# EAGLE design design1 (EAGLE 7.3.0)
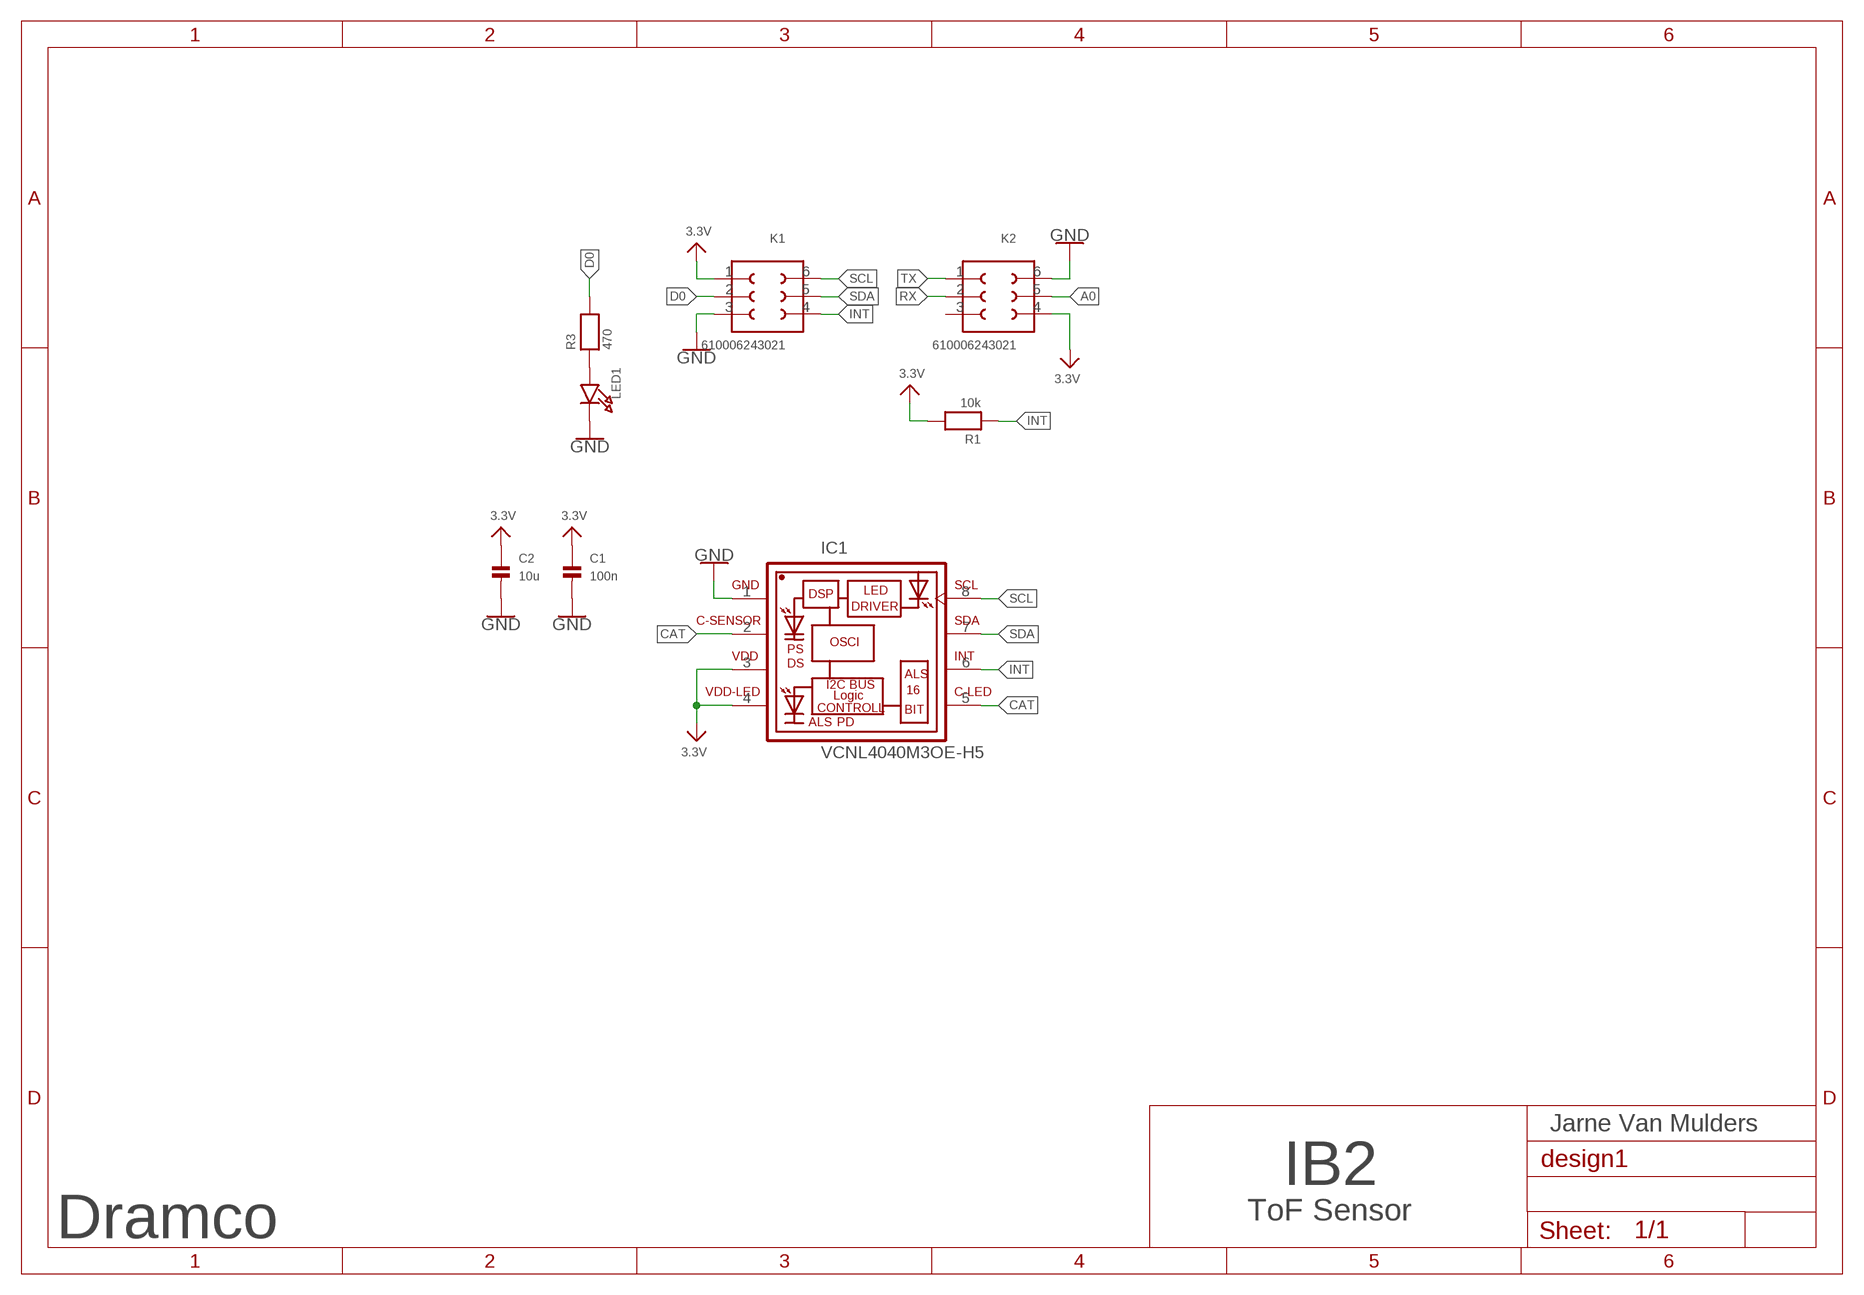
[diagram p0: schematic, sheet 1]

## Parts
C1  100n  CAP_CERAMIC0603  [0603]
C2  10u  CAP_CERAMIC0805  [0805]
IC1  VCNL4040M3OE-H5  [VISHAY_VCNL4040_4.34X2.35X3.65]
K1  610006243021  [610006243021]
K2  610006243021  [610006243021]
LED1  LED0805  [CHIPLED_0805]
R1  10k  RESISTOR0603  [0603]
R3  470  RESISTOR0603  [0603]

## Nets
3.3V: C1.1 C2.1 IC1.3(VDD) IC1.4(VDD-LED) K1.1 K2.4 R1.2
A0: K2.5
CAT: IC1.2(C-SENSOR) IC1.5(C-LED)
D0: K1.2 R3.2
GND: C1.2 C2.2 IC1.1(GND) K1.3 K2.6 LED1.C
INT: IC1.6(INT) K1.4 R1.1
N$3: LED1.A R3.1
RX: K2.2
SCL: IC1.8(SCL) K1.6
SDA: IC1.7(SDA) K1.5
TX: K2.1
Unconnected: K2.3

## Notes on the sheet
- Jarne Van Mulders
- IB2
- ToF Sensor
- Dramco

## Library data of the parts
C1 C2 = microbuilder:CAP_CERAMIC: Ceramic Capacitors 0402 - 0402 Surface Mount Capacitors 16pF 50V 5% [Digikey: 445-4899-2-ND] 18pF 50V 5% [Digikey: 490-1281-2-ND] 22pF 50V 5% [Digikey: 490-1283-2-ND] 68pF 50V 5% [Digikey: 490-1289-2-ND] 0.1uF 10V 10% [Digikey: 490-1318-2-ND] 1.0uF 6.3V 10% [Digikey: 490-1320-2-ND] 0603 - 0603 Surface Mount Capacitors 16 pF 50V 5% [Digikey: 445-5051-2-ND] 22 pF 50V [Digikey: PCC220ACVTR-ND] 33 pF 50V 5% [Digikey: 490-1415-1-ND] 56pF 50V 5% [Digikey: 490-1421-1-ND] 220pF 50V 5% [Digikey: 445-1285-1-ND] 680 pF 50V 2200 pF 50V 5% C0G [Digikey: 445-1297-1-ND] 5600 pF 100V 5% X7R [Digikey: 478-3711-1-ND] 0.1 µF 25V 10% [Digikey: PCC2277TR-ND] 0.22 µF 16V 10% X7R [Digikey: 445-1318-1-ND] 1.0 µF 25V 10% [Digikey: 445-5146-2-ND] 0603 - RF Specific 3pF 250V +/-0.1pF RF [Digikey: 712-1347-1-ND] 18 pF 250V 5% [Digikey: 478-3505-1-ND or 712-1322-1-ND] 56 pF 250V 5% C0G RF [Digikey: 490-4867-1-ND] 68 pF 250V RF [Digikey: 490-4868-1-ND] 0805 - 0805 Surface Mount Capacitors 220 pF 250V 2% RF Ceramic Capacitor [Digikey: 712-1398-1-ND] 1000 pF 50V 2% NP0 Ceramic Capacitor [Digikey: 478-3760-1-ND] 0.1 µF 25V 10% Ceramic Capacitor [Digikey: PCC1828TR-ND] 1.0 µF 16V 10% Ceramic Capacitor[Digikey: 490-1691-2-ND] 10.0 µF 10V 10% Ceramic Capacitor[Digikey: 709-1228-1-ND] 10.0 uF 16V 10% Ceramic Capacitor [Digikey: 478-5165-2-ND] 47 uF 6.3V 20% Ceramic Capacitor [Digikey: 587-1779-1-ND or 399-5506-1-ND] 1206 - 1206 Surface Mount Capacitors 47uF 10V 20% Ceramic Capacitor [Digikey: 490-5528-1-ND or 399-5508-1-ND or 445-6010-1-ND] 100uF 6.3V -20%, +80% Y5V Ceramic Capacitor (Digikey: 490-4512-1-ND, Mouser: 81-GRM31CF50J107ZE1L)
IC1 = VCNL4040M3OE-H5:VCNL4040M3OE-H5: VCNL4040 Fully Integrated Proximity and Ambient Light Sensor with Infrared Emitter, I2C Interface, and Interrupt Function: VCNL4040 integrates a proximity sensor (PS), ambient light sensor (ALS), and a high power IRED into one small package. It incorporates photodiodes, amplifiers, and analog to digital converting circuits into a single chip by CMOS process. The 16-bit high resolution ALS offers excellent sensing capabilities with sufficient selections to fulfill most applications whether dark or high transparency lens design. High and low interrupt thresholds can be programmed for both ALS and PS, allowing the component to use a minimal amount of the microcontrollers resources. Device Model created 15.06.2016 by Johannes Kolb - Vishay Semiconductor GmbH Check prices <https://pricing.snapeda.com/parts/VCNL4040M3OE-H5/Vishay%20Semiconductor/view-part?ref=eda>; AVAILABILITY: In Stock; DESCRIPTION: Optical Sensor Ambient 550nm I²C 8-SMD Module; MF: Vishay Semiconductor; MP: VCNL4040M3OE-H5; PACKAGE: SMD-8 Vishay; PRICE: None; PURCHASE-URL: https://pricing.snapeda.com/search/part/VCNL4040M3OE-H5/?ref=eda
K1 K2 = Wurth_Elektronik_Electromechanic_Board_to_Board_Connectors_rev15c:610006243021: WR-PHD 2.54mm SMT Dual Socket Header Bottom Entry, 6 Pins=>Code : Con_BTB_SHD_2.54_2_610006243021 <http://katalog.we-online.de/media/images/eican/Con_BTB_SHD_2.54_2_6100xx243021_pf2.jpg> Details see: http://katalog.we-online.de/en/em/610_0xx_243_021 Created 2014-05-30, Karrer Zheng 2014 (C) Würth Elektronik
LED1 = microbuilder:LED: LED 0603 - 0603 Surface Mount Package 2mA: Green LED - Low Power (3.9mcd, 2ma, 1.7Vf) - Digikey: 475-2709-2-ND Orange LED - Low Power (9.8mcd, 2ma, 1.8Vf) - Digikey: 475-1194-2-ND Red LED - Low Power (5mcd, 2ma, 1.8Vf) - Digikey: 475-1195-2-ND Yellow LED - Low Power (7mcd, 2ma, 1.8Vf) - Digikey: 475-1196-2-ND 5mA: Blue LED - Low Power (17mcd, 5ma, 2.9Vf) - Digikey: LNJ937W8CRACT-ND 0805 - 0805 Surface Mount Package 2mA: Red LED (8.8mcd, 2mA, 1.8Vf, Clear) - Low Power [Digikey: 475-2510-1-ND] Green LED (5mcd, 2mA, 1.8Vf, Clear) - Low Power [Digikey: 475-2730-1-ND] Yellow LED (11.3mcd, 2mA, 1.8Vf, Clear) - Low Power [Digikey: 475-2555-1-ND] 20mA: Red LED (104mcd, 20mA, Diffused) - LS R976 [Digikey: 475-1278-6-ND] Red LED (12mcd, 20mA, 2.0Vf, Clear) - APT2012EC [Digikey: 754-1128-1-ND] Green LED (15mcd, 20mA, 2.2Vf, Clear) - APT2012GC [Digikey: 754-1131-1-ND] Orange LED (160mcd, 20mA, 2.1Vf, Clear) - APT2012SECK [Digikey: 754-1130-1-ND] 1206 - 1206 Surface Mount Package Green LED (26mcd, 20mA, Diffused) - LG N971 [Digikey: 475-1407-6-ND] Red LED (15mcd, 20mA, Diffused) - LH N974 [Digikey: 475-1416-6-ND]
R1 R3 = microbuilder:RESISTOR: Resistors 0402 - 0402 Surface Mount Package 22 Ohm 1% 1/16W [Digikey: 311-22.0LRTR-ND] 33 Ohm 5% 1/16W 1.0K 5% 1/16W 1.5K 5% 1/16W 2.0K 1% 1/16W 10.0K 1% 1/16W [Digikey: 311-10.0KLRTR-ND] 10.0K 5% 1/16W [Digikey: RMCF0402JT10K0TR-ND] 12.1K 1% 1/16W [Digikey: 311-22.0LRTR-ND] 100.0K 5% 1/16W 0603 - 0603 Surface Mount Package 0 Ohm 1/10 Watt 1% Resistor 15 Ohm 1/10 Watt 1% Resistor 33 Ohm 1/10 Watt 1% Resistor 49.9 Ohm 1/10 Watt 1% Resistor 100 Ohm 1/10 Watt 1% Resistor 150 Ohm 1/10 Watt 1% Resistor 240 Ohm 1/10 Watt 1% Resistor 390 Ohm 1/10 Watt 1% Resistor 560 Ohm 1/10 Watt 1% Resistor 680 Ohm 1/10 Watt 1% Resistor 750 Ohm 1/10 Watt 1% Resistor 1.0K Ohm 1/10 Watt 1% Resistor 1.5K Ohm 1/10 Watt 1% Resistor 2.0K Ohm 1/10 Watt 1% Resistor 2.2K Ohm 1/10 Watt 1% Resistor 3.3K Ohm 1/10 Watt 1% Resistor 4.7K Ohm 1/10 Watt 1% Resistor 10.0K Ohm 1/10 Watt 1% Resistor 12.0K Ohm 1/10 Watt 1% Resistor 12.1K Ohm 1/10 Watt 1% Resistor 20.0K Ohm 1/10 Watt 1% Resistor 33.0K Ohm 1/10 Watt 1% Resistor 100.0K Ohm 1/10 Watt 1% Resistor 0805 - 0805 Surface Mount Package 0 Ohm 1/8 Watt 1% Resistor 33 Ohm 1/8 Watt 1% Resistor 100 Ohm 1/8 Watt 1% Resistor 150 Ohm 1/8 Watt 1% Resistor 200 Ohm 1/8 Watt 1% Resistor 240 Ohm 1/8 Watt 1% Resistor 330 Ohm 1/8 Watt 1% Resistor 390 Ohm 1/8 Watt 1% Resistor 470 Ohm 1/8 Watt 1% Resistor 1.0K Ohm 1/8 Watt 1% Resistor 1.5K Ohm 1/8 Watt 1% Resistor 2.0K Ohm 1/8 Watt 1% Resistor 4.7K Ohm 1/8 Watt 1% Resistor 5.1K Ohm 1/8 Watt 1% Resistor 5.6K Ohm 1/8 Watt 1% Resistor 10.0K Ohm 1/8 Watt 1% Resistor 22.0K Ohm 1/8 Watt 1% Resistor 33.0K Ohm 1/8 Watt 1% Resistor 100K Ohm 1/8 Watt 1% Resistor 1206 - 1206 Surface Mount Package 2012 - 2010 Surface Mount Package 0.11 Ohm 1/2 Watt 1% Resistor - Digikey: RHM.11UCT-ND

## Board
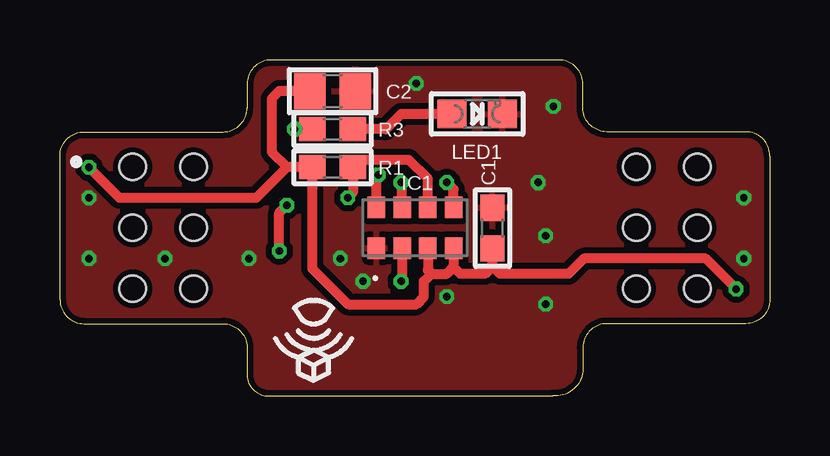
[diagram p1: board, top side]
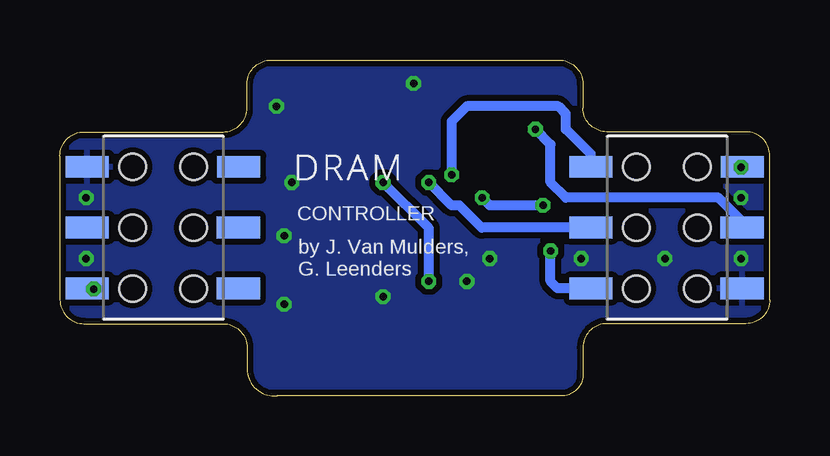
[diagram p2: board, bottom side, seen from below]

Size 29.6 x 14.01 mm. Coordinates in mm from the lower left corner, seen from the top.
Outline: 0,4.01 0,10.01 arc-90 1,11.01 6.8,11.01 arc90 7.8,12.01 7.8,13.01 arc-90 8.8,14.01 20.8,14.01 arc-90 21.8,13.01 21.8,12.01 arc90 22.8,11.01 28.6,11.01 arc-90 29.6,10.01 29.6,4.01 arc-90 28.6,3.01 22.8,3.01 arc90 21.8,2.01 21.8,1.01 arc-90 20.55,0.01 8.55,0.01 arc-90 7.8,1.01 7.8,2.01 arc90 6.8,3.01 1,3.01 arc-90 0,4.01
Copper layers (1*16): Top 0.035mm / dielectric 1.5mm / Bottom 0.035mm
Design rules "SeeedStudio_2layer_DRU_no_angle_20140221": minimum track width 6mil, minimum drill 12mil, track to track 6mil, track to pad 6mil, pad to pad 6mil, via to via 6mil, smd to smd 0mil, copper to edge 10mil, drill to drill 10mil, minimum pad ring 10mil, minimum via ring 6mil, stop-mask expansion 2mil, vias tented up to drill 100mil, thermal gap 10mil

### Footprints (pad centres in the part's own frame; a part is rotated, then mirrored left to right if it is on the bottom)
0603 = smd 1.1 x 1: 1 -0.85,0; 2 0.85,0
0805 = smd 1.3 x 1.5: 1 -0.95,0; 2 0.95,0
VISHAY_VCNL4040_4.34X2.35X3.65 = smd 0.9 x 0.725: 1 -0.85,1.613; 2 -0.85,0.537; 3 -0.85,-0.537; 4 -0.85,-1.613; 5 0.85,-1.613; 6 0.85,-0.537; 7 0.85,0.537; 8 0.85,1.612
610006243021 = smd 0.9 x 1.8: 1 -2.54,3.15; 2 -0.01,3.14; 3 2.53,3.14; 4 2.53,-3.16; 5 -0.01,-3.16; 6 -2.54,-3.17 | hole 1.1: -2.54,1.27; 0,1.27; 0,-1.27; -2.54,-1.27; 2.54,1.27; 2.54,-1.27
CHIPLED_0805 = smd 1.2 x 1.2: A 0,-1.05; C 0,1.05

### Placement (x,y rotation side)
C1  18.03,6.99 90 top
C2  11.37,12.71 0 top
IC1  14.8,7.01 90 top
K1  4.3,7.01 270 bottom
K2  25.3,7.01 270 bottom
LED1  17.4,11.75 270 top
R1  11.37,9.53 180 top
R3  11.37,11.12 180 top

### Tracks (layer width: path | path; a pad name or v marks a point on that pad's centre or on a via)
3.3V  (via drill 0.31)
  Top 0.406: v1.21,9.53 2.47,8.26 8.19,8.26 9.46,9.53 | 9.46,9.53 R1.2 10.52,5.3 12,3.82 14.86,3.82 15.18,4.13 15.18,4.77 15.49,5.09 | IC1.3 15.34,5.24 15.49,5.09 | 18.03,5.4 17.71,5.09 16.7,5.09 16.41,5.37 | 18.03,5.4 C1.1 | IC1.4 16.41,5.37 | 16.41,5.37 16.13,5.09 15.49,5.09 | C2.1 9.14,12.71 8.83,12.39 8.83,10.17 9.46,9.53 | v28.19,4.45 26.92,5.72 21.84,5.72 21.21,5.09 18.35,5.09 18.03,5.4
  Bottom 0.406: K1.1 1.19,9.55 v1.21,9.53 | K2.4 28.22,4.48 v28.19,4.45
CAT  (via drill 0.31)
  Top 0.406: IC1.2 14.26,4.81 v14.22,4.77 | IC1.5 16.41,8.61 v16.13,8.9
  Bottom 0.406: v14.22,4.77 14.22,6.99 v16.13,8.9
D0  (via drill 0.31)
  Top 0.406: v9.78,11.12 R3.2
  Bottom 0.406: K1.2 1.16,7.26 2.16,8.26 8.51,8.26 9.14,8.9 9.14,10.48 v9.78,11.12
GND  (via drill 0.31)
  other vias: 1.21,8.26 1.21,5.72 28.51,8.26 28.51,5.72 11.68,5.72 19.94,8.9 14.86,13.02 20.57,12.07 20.25,6.67 20.25,3.82 16.13,4.13 12.64,4.77 7.87,5.72 4.38,5.72
  pour Bottom (isolate 0.254): -4.2,17.01 33.55,17.01 33.55,-3.74 -4.2,-3.74
  pour Top (isolate 0.254): -4.45,18.76 36.05,18.76 36.05,-4.74 -3.95,-4.74 arc-90 -4.45,-4.24
INT  (via drill 0.31)
  Top 0.406: IC1.6 15.34,9.05 14.54,9.85 12.64,9.85 12.32,9.53 R1.1 12.21,8.48 v12,8.26 | v9.14,6.04 9.14,7.63 v9.46,7.94
  Bottom 0.406: K1.4 8.85,4.48 9.14,4.77 v9.14,6.04 | v9.46,7.94 11.68,7.94 v12,8.26
N$3
  Top 0.406: LED1.A 14.22,11.75 13.59,11.12 R3.1
SCL  (via drill 0.31)
  Top 0.406: v13.27,9.21 13.19,9.13 IC1.8
  Bottom 0.406: K1.6 7.47,10.08 8.51,11.12 8.51,11.75 8.83,12.07 12.64,12.07 13.27,11.44 v13.27,9.21
SDA  (via drill 0.31)
  Top 0.406: IC1.7 14.26,8.86 v14.22,8.9
  Bottom 0.406: K1.5 12.03,7.02 12.95,7.94 13.27,7.94 v14.22,8.9

### Text on the board
bPlace: CONTROLLER | by J. Van Mulders, / G. Leenders